# EAGLE design Main_BoardV1 (EAGLE 9.6.2)
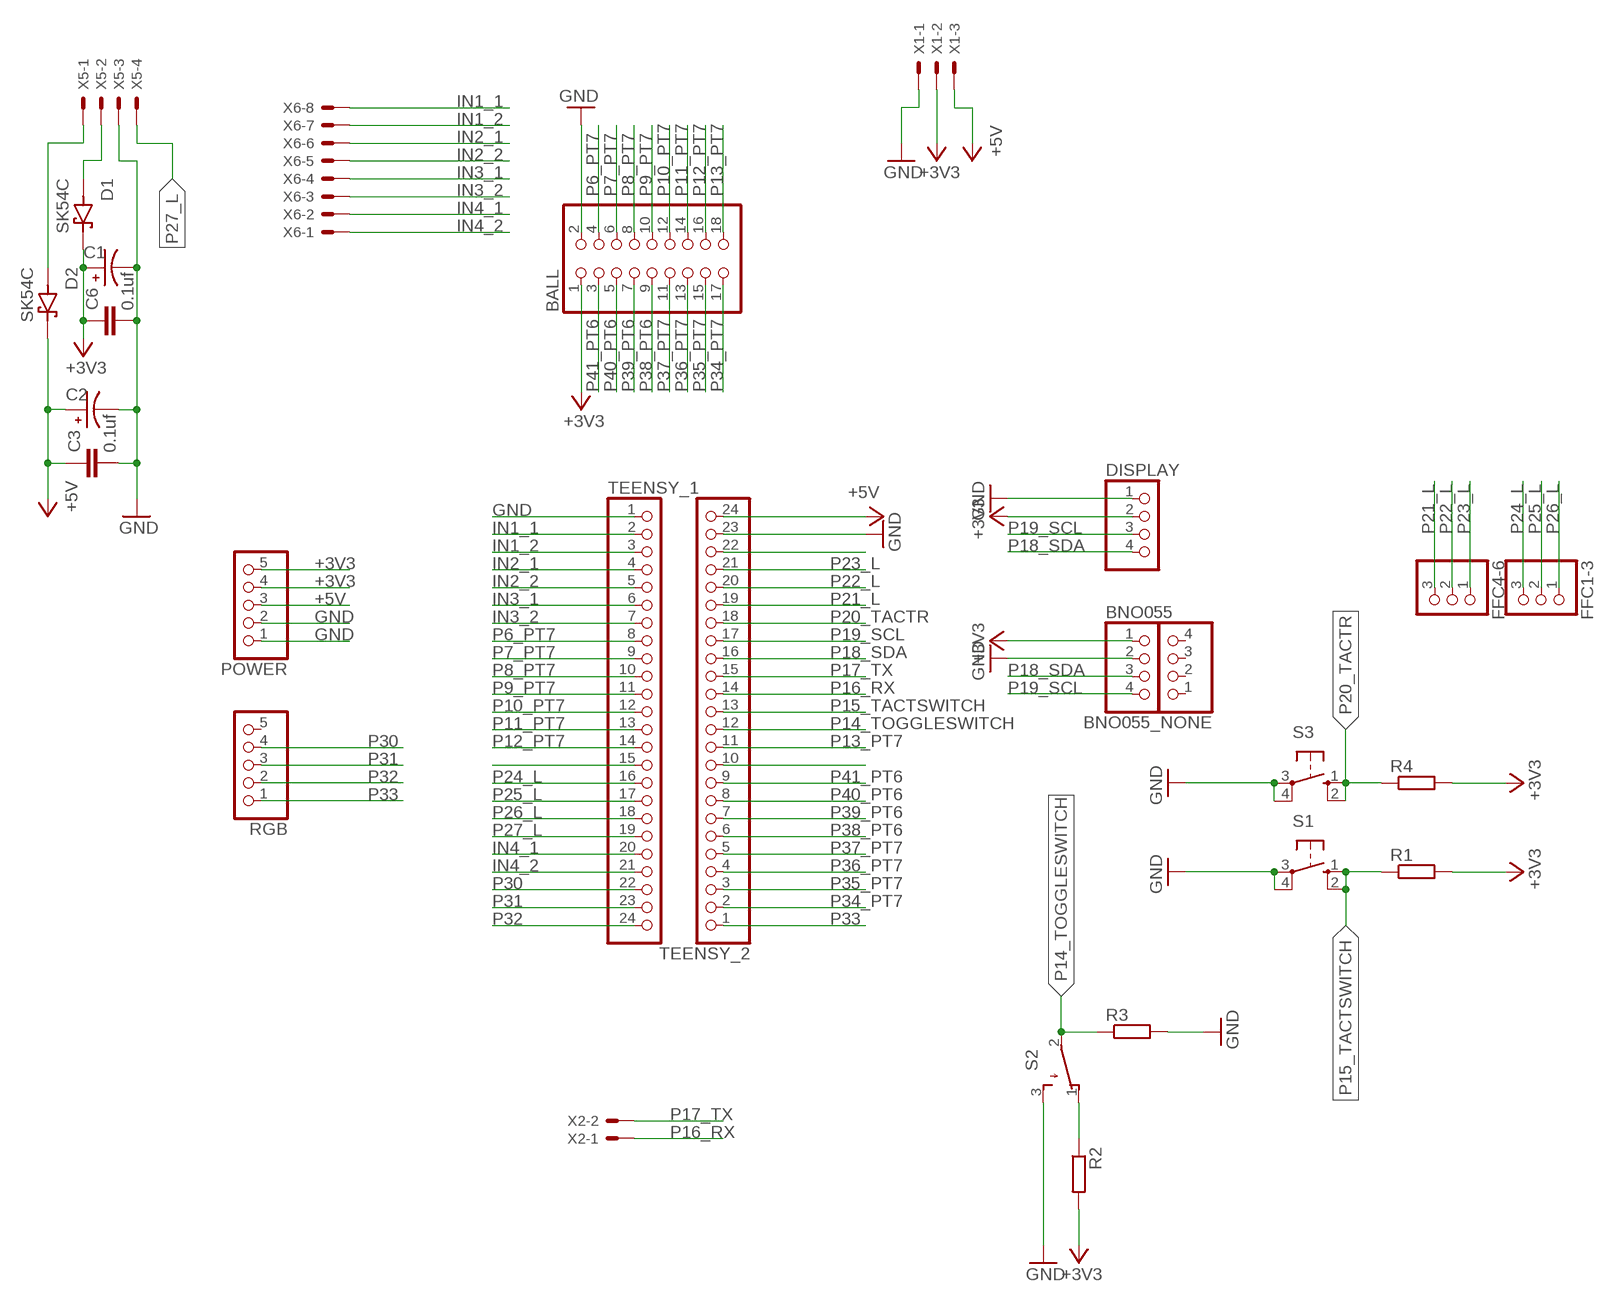
[diagram p0: schematic, sheet 1]

## Parts
BALL  PINHD-2X9  [2X09]
BNO055  PINHD-1X4  [1X04]
BNO055_NONE  PINHD-1X4  [1X04]
C1  EEEFK1E332AM  [CAP_EEEFK1E332AM]
C2  EEEFK1E332AM  [CAP_EEEFK1E332AM]
C3  0.1uf  C-EUC0603  [C0603]
C6  0.1uf  C-EUC0603  [C0603]
D1  SK54C  [DIOM6859X262N]
D2  SK54C  [DIOM6859X262N]
DISPLAY  PINHD-1X04_2.54-S  [1X04-S]
FFC1-3  PINHD-1X03_2.54-S  [1X03-S]
FFC4-6  PINHD-1X03_2.54-S  [1X03-S]
POWER  PINHD-1X05_2.54-S  [1X05-S]
R1  R-EU_0207/10  [0207/10]
R2  R-EU_0207/10  [0207/10]
R3  R-EU_0207/10  [0207/10]
R4  R-EU_0207/10  [0207/10]
RGB  PINHD-1X05_2.54-S  [1X05-S]
S1  40-XX  [B3F-40XX]
S2  TL32PO  [TL3XPO]
S3  10-XX  [B3F-10XX]
TEENSY_1  PINHD-1X24  [1X24]
TEENSY_2  PINHD-1X24  [1X24]
X1  JST-XH-03-PIN-ROUND-PAD  [JST-XH-03-PACKAGE-ROUND-PAD]
X2  JST-XH-02-PIN-ROUND-PAD  [JST-XH-02-PACKAGE-ROUND-PAD]
X5  JST-XH-04-PIN-ROUND-PAD  [JST-XH-04-PACKAGE-ROUND-PAD]
X6  JST-XH-08-PIN-ROUND-PAD  [JST-XH-08-PACKAGE-ROUND-PAD]

## Nets
+3V3: BALL.1 BNO055.1 C1.1 C6.1 D1.C(K) DISPLAY.2 POWER.4 POWER.5 R1.2 R2.2 R4.2 X1.2
+5V: C2.1 C3.1 D2.C(K) POWER.3 TEENSY_2.24 X1.3
GND: BALL.2 BNO055.2 C1.2 C2.2 C3.2 C6.2 DISPLAY.1 POWER.1 POWER.2 R3.2 S1.3(P) S1.4(P1) S2.3(S) S3.3(P) S3.4(P1) TEENSY_1.1 TEENSY_2.23 X1.1 X5.3
IN1_1: TEENSY_1.2 X6.8
IN1_2: TEENSY_1.3 X6.7
IN2_1: TEENSY_1.4 X6.6
IN2_2: TEENSY_1.5 X6.5
IN3_1: TEENSY_1.6 X6.4
IN3_2: TEENSY_1.7 X6.3
IN4_1: TEENSY_1.20 X6.2
IN4_2: TEENSY_1.21 X6.1
N$1: D1.A X5.2
N$2: D2.A X5.1
N$3: TEENSY_2.22
N$8: R2.1 S2.1(O)
N$16: TEENSY_2.10
N$35: TEENSY_1.15
P6_PT7: BALL.4 TEENSY_1.8
P7_PT7: BALL.6 TEENSY_1.9
P8_PT7: BALL.8 TEENSY_1.10
P9_PT7: BALL.10 TEENSY_1.11
P10_PT7: BALL.12 TEENSY_1.12
P11_PT7: BALL.14 TEENSY_1.13
P12_PT7: BALL.16 TEENSY_1.14
P13_PT7: BALL.18 TEENSY_2.11
P14_TOGGLESWITCH: R3.1 S2.2(P) TEENSY_2.12
P15_TACTSWITCH: R1.1 S1.1(S) S1.2(S1) TEENSY_2.13
P16_RX: TEENSY_2.14 X2.1
P17_TX: TEENSY_2.15 X2.2
P18_SDA: BNO055.3 DISPLAY.4 TEENSY_2.16
P19_SCL: BNO055.4 DISPLAY.3 TEENSY_2.17
P20_TACTR: R4.1 S3.1(S) S3.2(S1) TEENSY_2.18
P21_L: FFC4-6.3 TEENSY_2.19
P22_L: FFC4-6.2 TEENSY_2.20
P23_L: FFC4-6.1 TEENSY_2.21
P24_L: FFC1-3.3 TEENSY_1.16
P25_L: FFC1-3.2 TEENSY_1.17
P26_L: FFC1-3.1 TEENSY_1.18
P27_L: TEENSY_1.19 X5.4
P30: RGB.4 TEENSY_1.22
P31: RGB.3 TEENSY_1.23
P32: RGB.2 TEENSY_1.24
P33: RGB.1 TEENSY_2.1
P34_PT7: BALL.17 TEENSY_2.2
P35_PT7: BALL.15 TEENSY_2.3
P36_PT7: BALL.13 TEENSY_2.4
P37_PT7: BALL.11 TEENSY_2.5
P38_PT6: BALL.9 TEENSY_2.6
P39_PT6: BALL.7 TEENSY_2.7
P40_PT6: BALL.5 TEENSY_2.8
P41_PT6: BALL.3 TEENSY_2.9
Unconnected: BNO055_NONE.1 BNO055_NONE.2 BNO055_NONE.3 BNO055_NONE.4 RGB.5

## Library data of the parts
BALL = pinhead:PINHD-2X9: PIN HEADER
BNO055 BNO055_NONE = pinhead:PINHD-1X4: PIN HEADER
C1 C2 = EEEFK1E332AM:EEEFK1E332AM: Check availability <https://pricing.snapeda.com/parts/EEEFK1E332AM/Panasonic/view-part?ref=eda>; AVAILABILITY: In Stock; DESCRIPTION: 3300µF 25V Aluminum Electrolytic Capacitors Radial, Can - SMD 5000 Hrs @ 105°C; MF: Panasonic; MP: EEEFK1E332AM; PACKAGE: RADIAL-2 Panasonic; PRICE: None; PURCHASE-URL: https://pricing.snapeda.com/search/part/EEEFK1E332AM/?ref=eda
C3 C6 = rcl:C-EU: CAPACITOR, European symbol; SPICEPREFIX: C
D1 D2 = SK54C:SK54C: Check availability <https://pricing.snapeda.com/parts/SK54C/Taiwan%20Semiconductor/view-part?ref=eda>; AVAILABILITY: In Stock; DESCRIPTION: 5A, 40V, Schottky Rectifier; MF: Taiwan Semiconductor; MP: SK54C; PACKAGE: SMC-2 Taiwan Semiconductor; PRICE: None; PURCHASE-URL: https://pricing.snapeda.com/search/part/SK54C/?ref=eda
DISPLAY = pinhead-2:PINHD-1X04: PIN HEADER
FFC1-3 FFC4-6 = pinhead-2:PINHD-1X03: PIN HEADER
POWER RGB = pinhead-2:PINHD-1X05: PIN HEADER
R1-R4 = rcl:R-EU_: RESISTOR, European symbol; SPICEPREFIX: R
S1 = switch-omron:40-XX: OMRON SWITCH; MF: OMRON COMPONENTS USA; MPN: B3F-4000; OC_FARNELL: 176434; OC_NEWARK: 36K3105
S2 = switch:TL32PO: TINY SWITCH ON - MOM Source: http://www2.produktinfo.conrad.com/datenblaetter/700000-724999/705152-da-01-de-Subminiaturschalter_TL_36YO.pdf
S3 = switch-omron:10-XX: OMRON SWITCH; MPN: B3F-1000; OC_FARNELL: 176432; OC_NEWARK: 36M3542
TEENSY_1 TEENSY_2 = pinhead:PINHD-1X24: PIN HEADER
X1 = Rembrandt Electronics - JST XH Connectors v1-0:JST-XH-03-PIN: JST XH Connector 2 Pin Wire to board connector. Pitch: 2,54 mm, (0.100") Number of pins: 3 Created by Rembrandt Electronics www.rembrandtelectronics.com
X2 = Rembrandt Electronics - JST XH Connectors v1-0:JST-XH-02-PIN: JST XH Connector 2 Pin Wire to board connector. Pitch: 2,54 mm, (0.100") Number of pins: 2 Created by Rembrandt Electronics www.rembrandtelectronics.com
X5 = Rembrandt Electronics - JST XH Connectors v1-0:JST-XH-04-PIN: JST XH Connector 2 Pin Wire to board connector. Pitch: 2,54 mm, (0.100") Number of pins: 4 Created by Rembrandt Electronics www.rembrandtelectronics.com
X6 = Rembrandt Electronics - JST XH Connectors v1-0:JST-XH-08-PIN: JST XH Connector 2 Pin Wire to board connector. Pitch: 2,54 mm, (0.100") Number of pins: 8 Created by Rembrandt Electronics www.rembrandtelectronics.com

## Net classes
0 default: clearance 1 mm

## Board
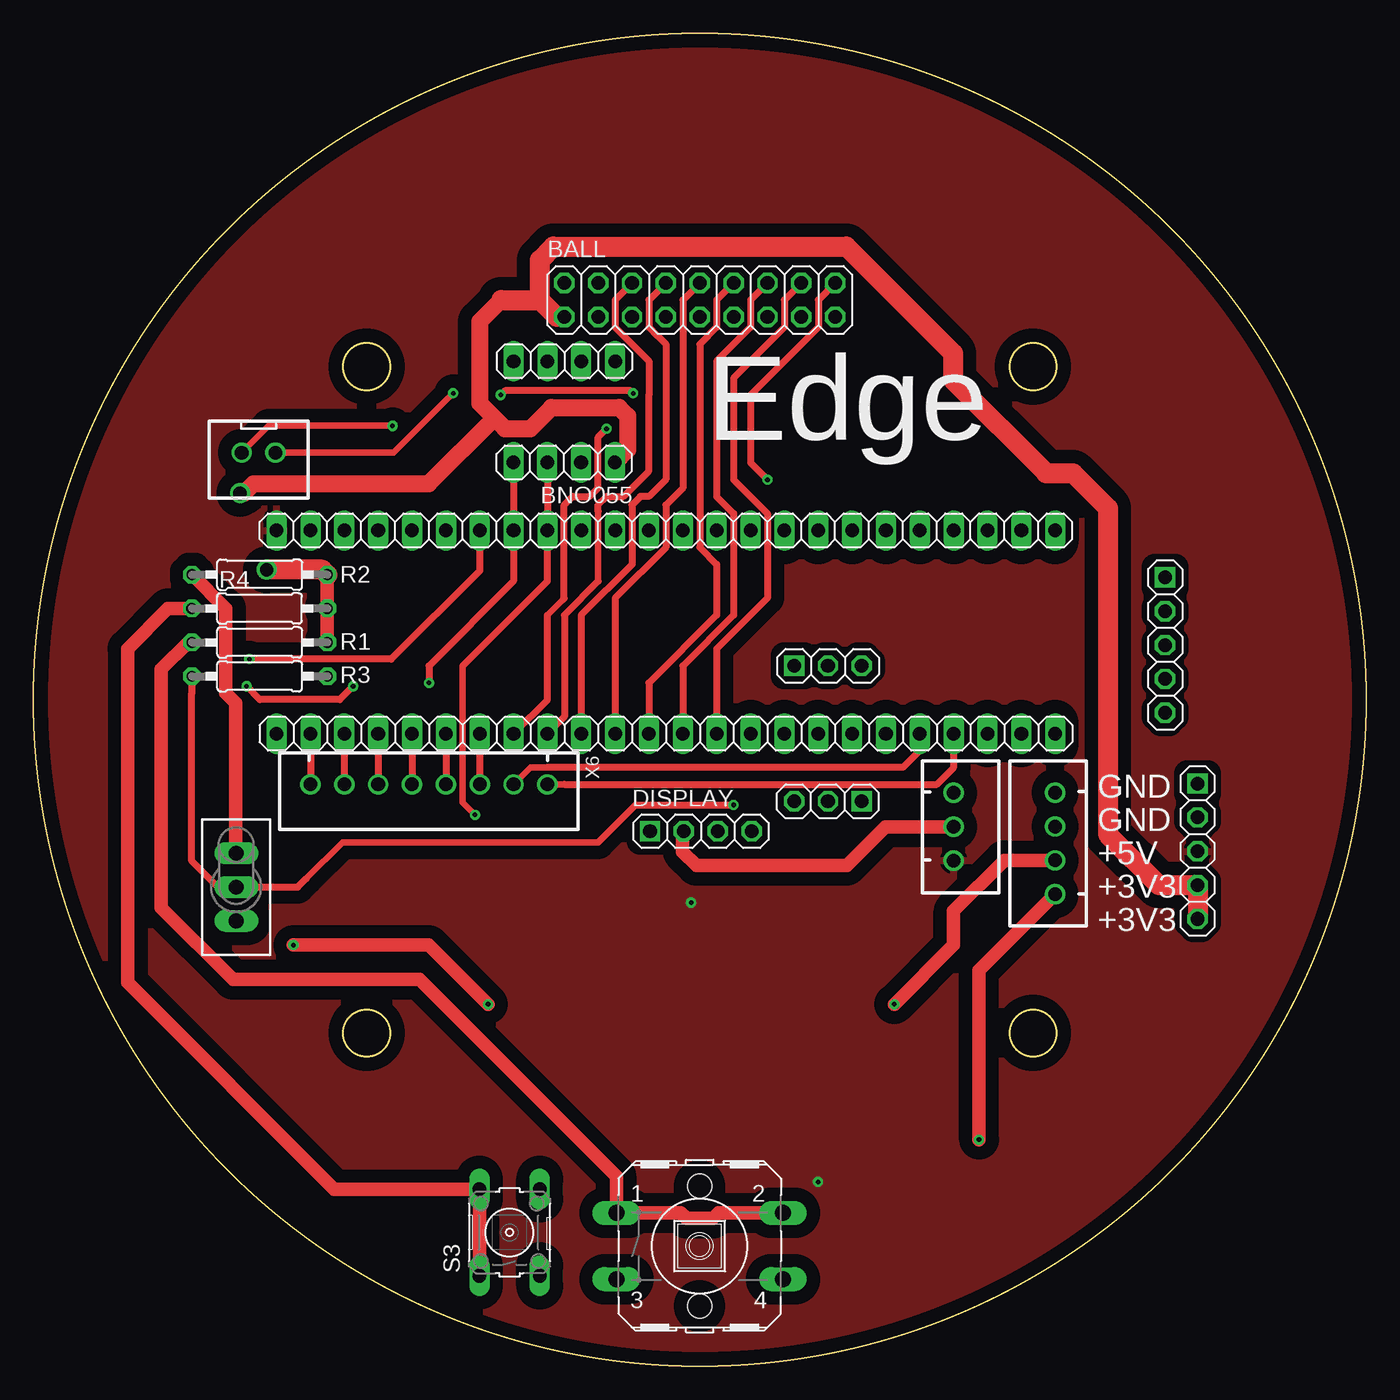
[diagram p1: board, top side]
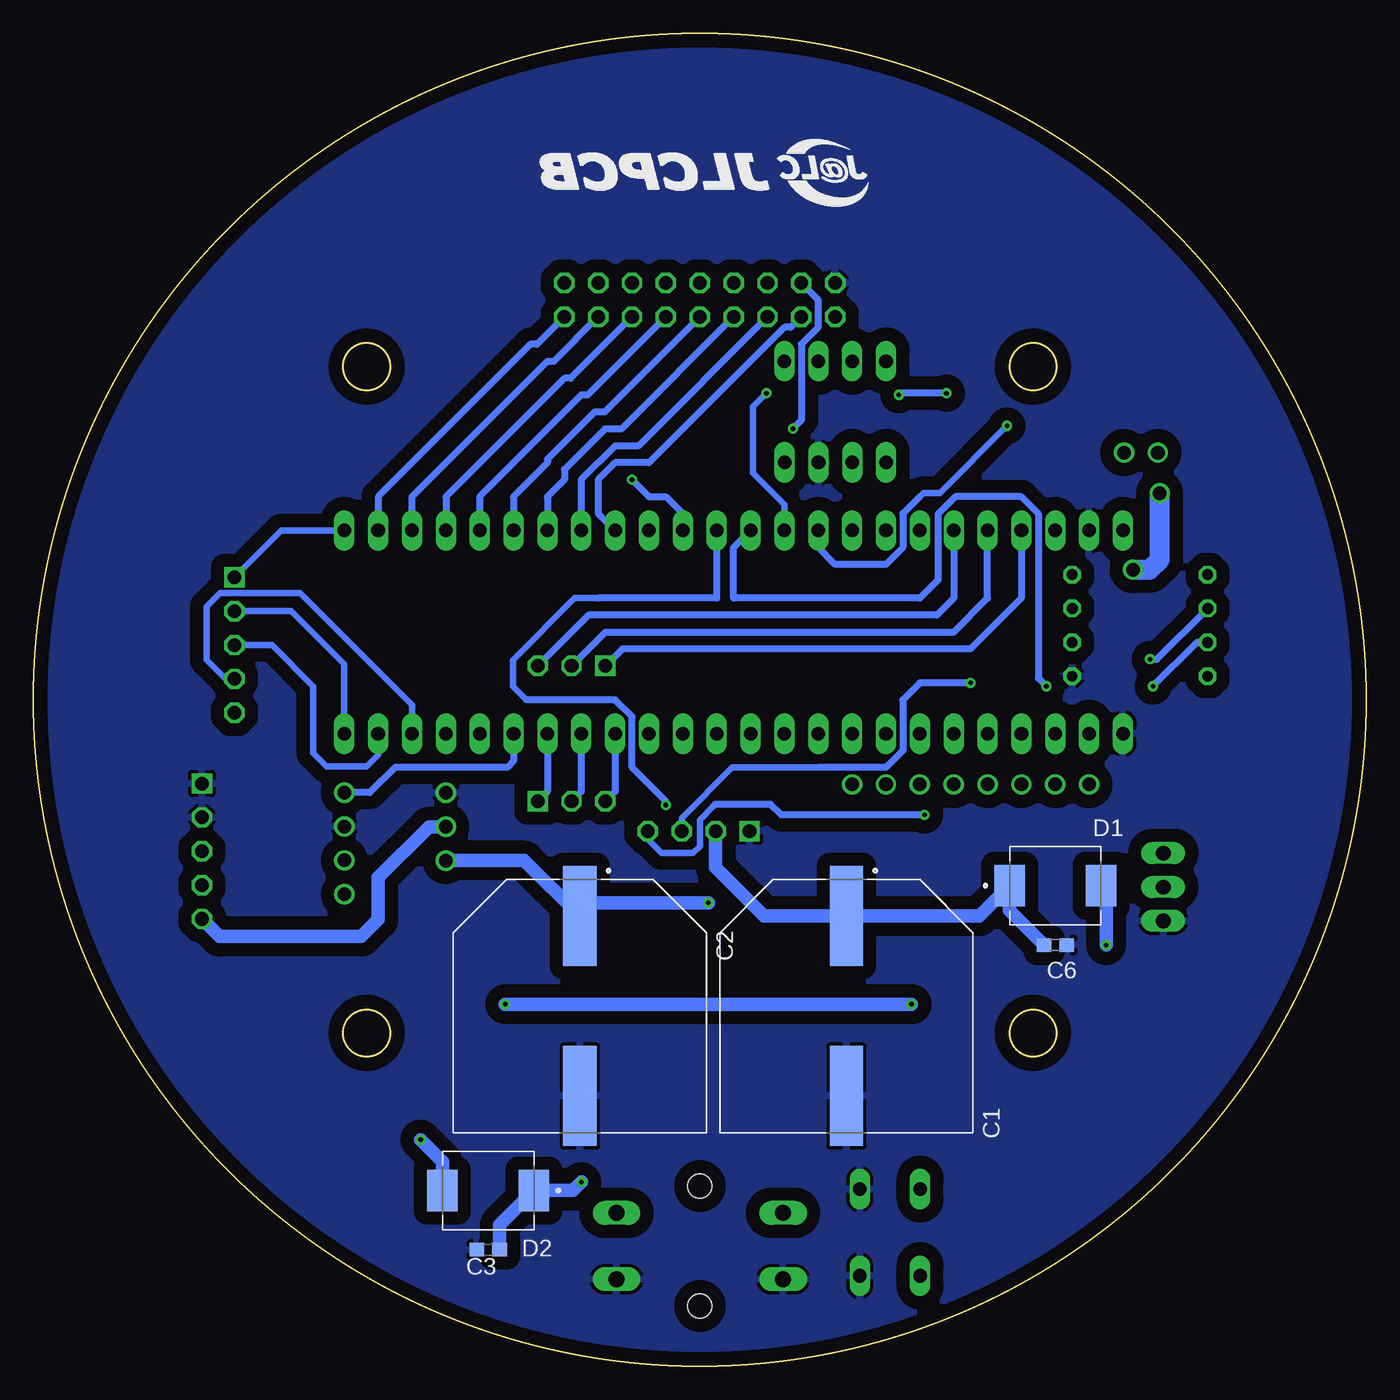
[diagram p2: board, bottom side, seen from below]

Size 100 x 100 mm. Coordinates in mm from the lower left corner, seen from the top.
Outline: circle at 50,50 radius 50
Outline: circle at 75,75 radius 1.75
Outline: circle at 25,75 radius 1.75
Outline: circle at 25,25 radius 1.75
Outline: circle at 75,25 radius 1.75
Copper layers (1*16): Top 0.035mm / dielectric 1.5mm / Bottom 0.035mm
Design rules "default": minimum track width 6mil, minimum drill 0.35mm, track to track 6mil, track to pad 6mil, pad to pad 6mil, via to via 6mil, smd to smd 6mil, copper to edge 40mil, drill to drill 6mil, minimum pad ring 10mil, minimum via ring 8mil, stop-mask expansion 4mil, vias tented up to drill 0mil, thermal gap 10mil

### Footprints (pad centres in the part's own frame; a part is rotated, then mirrored left to right if it is on the bottom)
2X09 = drill 1.016 octagon: 1 -10.16,-1.27; 2 -10.16,1.27; 3 -7.62,-1.27; 4 -7.62,1.27; 5 -5.08,-1.27; 6 -5.08,1.27; 7 -2.54,-1.27; 8 -2.54,1.27; 9 0,-1.27; 10 0,1.27; 11 2.54,-1.27; 12 2.54,1.27; 13 5.08,-1.27; 14 5.08,1.27; 15 7.62,-1.27; 16 7.62,1.27; 17 10.16,-1.27; 18 10.16,1.27
1X04 = drill 1.016 long: 1 -3.81,0; 2 -1.27,0; 3 1.27,0; 4 3.81,0
CAP_EEEFK1E332AM = smd 7.5 x 2.5: 1 -6.75,0; 2 6.75,0
C0603 = smd 1.1 x 1: 1 -0.85,0; 2 0.85,0
DIOM6859X262N = smd 2.29 x 3.12: A 3.43,0; C -3.43,0
1X04-S = drill 1.016 square: 1 -3.81,0 | drill 1.016 octagon: 2 -1.27,0; 3 1.27,0; 4 3.81,0
1X03-S = drill 1.016 square: 1 -2.54,0 | drill 1.016 octagon: 2 0,0; 3 2.54,0
1X05-S = drill 1.016 square: 1 -5.08,0 | drill 1.016 octagon: 2 -2.54,0; 3 0,0; 4 2.54,0; 5 5.08,0
0207/10 = drill 0.813 octagon: 1 -5.08,0; 2 5.08,0
B3F-40XX = drill 1.194 long: 1 -6.248,2.489; 2 6.248,2.489; 3 -6.248,-2.489; 4 6.248,-2.489 | hole 1.803: 0,-4.496; 0,4.496
TL3XPO = drill 1.1 pad 1.422 long: 1 -2.54,0; 2 0,0; 3 2.54,0
B3F-10XX = drill 1.016 long: 1 -3.251,2.261; 2 3.251,2.261; 3 -3.251,-2.261; 4 3.251,-2.261
1X24 = drill 1.016 long: 1 -29.21,0; 2 -26.67,0; 3 -24.13,0; 4 -21.59,0; 5 -19.05,0; 6 -16.51,0; 7 -13.97,0; 8 -11.43,0; 9 -8.89,0; 10 -6.35,0; 11 -3.81,0; 12 -1.27,0; 13 1.27,0; 14 3.81,0; 15 6.35,0; 16 8.89,0; 17 11.43,0; 18 13.97,0; 19 16.51,0; 20 19.05,0; 21 21.59,0; 22 24.13,0; 23 26.67,0; 24 29.21,0
JST-XH-03-PACKAGE-ROUND-PAD = drill 1.016: 1 -2.54,0; 2 0,0; 3 2.54,0
JST-XH-02-PACKAGE-ROUND-PAD = drill 1.016: 1 -1.27,0; 2 1.27,0
JST-XH-04-PACKAGE-ROUND-PAD = drill 1.016: 1 -3.81,0; 2 -1.27,0; 3 1.27,0; 4 3.81,0
JST-XH-08-PACKAGE-ROUND-PAD = drill 1.016: 1 -8.89,0; 2 -6.35,0; 3 -3.81,0; 4 -1.27,0; 5 1.27,0; 6 3.81,0; 7 6.35,0; 8 8.89,0

### Placement (x,y rotation side)
BALL  50,80 0 top
BNO055  39.82,67.81 180 top
BNO055_NONE  39.84,75.4 0 top
C1  38.99,27.01 270 bottom
C2  58.99,27.01 270 bottom
C3  65.87,8.74 180 bottom
C6  23.32,31.6 0 bottom
D1  23.32,36.04 0 bottom
D2  65.87,13.18 180 bottom
DISPLAY  50.08,40.14 0 top
FFC1-3  59.62,42.38 180 top
FFC4-6  59.62,52.54 0 top
POWER  87.35,38.64 270 top
R1  16.98,54.3 0 top
R2  16.98,59.38 0 top
R3  16.98,51.76 0 top
R4  16.97,56.85 0 top
RGB  84.92,54.1 270 top
S1  49.99,9.01 0 top
S2  15.22,35.95 270 top
S3  35.73,10.03 90 top
TEENSY_1  47.46,47.46 0 top
TEENSY_2  47.46,62.7 180 top
X1  69.05,40.48 270 top
X2  16.9,68.54 180 top
X5  76.66,39.22 90 top
X6  29.68,43.65 180 top

### Tracks (layer width: path | path; a pad name or v marks a point on that pad's centre or on a via)
+3V3  (via drill 1)
  Top 1.016: R1.2 R4.2 R2.2 | DISPLAY.2 48.72,40.05 48.72,38.58 49.74,37.57 61.04,37.57 63.95,40.47 X1.2
  Top 1.27: 35.1,80 33.48,78.39 33.48,72.24 34.59,71.13 | 34.59,71.13 35.39,70.33 37.29,70.33 38.88,71.92 43.96,71.92 44.59,71.29 44.59,68.76 BNO055.1 | 34.59,71.13 29.67,66.2 16.52,66.2 15.82,65.5 v15.5,65.5
  Top 1.5: POWER.5 POWER.4 84.45,36.09 80.64,39.9 80.64,64.36 78,67 76,67 69,74 69,76 61,84 39,84 38,83 38,80 | BALL.1 39.27,78.73 38,80 | 35.1,80 38,80 | R2.2 21.68,59.76 v17.5,59.76
  Bottom 1.016: C6.1 26.75,34.18 D1.C 29.03,33.76 C1.1 45.17,33.76 48.81,37.4 DISPLAY.2 | X1.2 70.32,40.47 74.12,36.67 74.12,33.5 75.39,32.23 86.03,32.23 POWER.5
  Bottom 1.5: v17.5,59.76 16.24,59.76 15.5,60.5 v15.5,65.5
+5V  (via drill 0.35)
  Bottom 1.016: C3.1 65.02,10.6 D2.C 59.52,13.18 v58.88,13.82 | X1.3 63.16,37.93 C2.1 57.98,34.77 v49.36,34.77
  pour Top: 29.68,100.8 69.05,100.8 100.8,69.05 100.8,29.68 71.59,0.47 28.41,0.47 0.47,28.41 0.47,71.59
GND
  pour Bottom: 30.95,99.53 32.22,100.8 69.05,100.8 100.8,69.05 100.8,29.68 71.59,0.47 28.41,0.47 -0.8,29.68 -0.8,69.05 29.68,99.53
IN1_1
  Top 0.508: TEENSY_1.2 X6.8
IN1_2
  Top 0.508: TEENSY_1.3 X6.7
IN2_1
  Top 0.508: TEENSY_1.4 X6.6
IN2_2
  Top 0.508: TEENSY_1.5 X6.5
IN3_1
  Top 0.508: TEENSY_1.6 X6.4
IN3_2
  Top 0.508: TEENSY_1.7 X6.3
IN4_1
  Top 0.5: 38.57,44.92 37.3,44.92 X6.2
  Top 0.508: TEENSY_1.20 66.51,46.19 65.24,44.92 38.57,44.92
IN4_2
  Top 0.5: X6.1 39.84,43.65
  Top 0.508: TEENSY_1.21 69.05,44.92 67.78,43.65 39.84,43.65
N$1  (via drill 0.35)
  Top 1.016: v19.51,31.6 29.67,31.6 v34.12,27.15 | v64.6,27.15 69.04,31.6 69.04,34.14 72.85,37.95 X5.2
  Bottom 1.016: v19.51,31.6 19.51,35.66 D1.A | v34.12,27.15 v64.6,27.15
N$2  (via drill 0.35)
  Top 1.016: v70.95,16.99 70.95,29.69 X5.1
  Bottom 1.016: D2.A 69.3,15.34 v70.95,16.99
N$8
  Top 1.016: R2.1 14.43,56.85 14.43,50.52 15.19,49.76 15.19,39.09 15.22,39.06 S2.1
P6_PT7  (via drill 0.35)
  Top 0.5: 38.57,56.35 39.73,57.51
  Top 0.508: TEENSY_1.8 38.57,50 38.57,56.35 | 39.73,57.51 39.83,57.61 39.83,64.62 40.47,65.25 41.74,65.25 42.37,65.89 42.37,69.7 v43.01,70.33
  Bottom 0.508: v43.01,70.33 42.37,70.97 42.37,76.68 41.1,77.95 41.1,79.99 BALL.4
P7_PT7
  Top 0.5: 42.38,58.89 42.38,64.12
  Top 0.508: BALL.6 43.65,80 43.65,77.94 45.54,76.05 45.55,76.05 46.18,75.41 46.18,72.87 46.18,67.16 44.28,65.25 43.01,65.25 42.38,64.63 42.38,64.12 | TEENSY_1.9 39.84,48.73 39.84,56.35 42.38,58.89
P8_PT7
  Top 0.508: BALL.8 46.19,80 46.19,77.94 46.81,77.32 46.82,77.32 47.45,76.68 47.45,66.52 46.18,65.25 45.55,65.25 44.91,64.62 44.91,60.17 44.92,60.16 41.11,56.35 TEENSY_1.10
P9_PT7
  Top 0.508: BALL.10 48.73,80 48.73,65.9 47.45,64.62 47.45,61.44 47.46,61.43 43.65,57.62 TEENSY_1.11
P10_PT7
  Top 0.508: BALL.12 51.27,80 51.27,77.94 50,76.67 50,61.43 51.27,60.16 51.27,56.35 46.19,51.27 TEENSY_1.12
P11_PT7
  Top 0.508: BALL.14 53.81,80 53.81,77.94 51.27,75.4 51.27,65.24 52.54,63.97 52.54,56.35 48.73,52.54 TEENSY_1.13
P12_PT7
  Top 0.508: BALL.16 56.35,80 56.35,77.94 52.54,74.13 52.54,66.51 55.08,63.97 55.08,57.62 51.27,53.81 TEENSY_1.14
P13_PT7  (via drill 0.35)
  Top 0.508: BALL.18 58.89,80 58.89,77.94 53.81,72.86 53.81,67.78 v55.08,66.51
  Bottom 0.508: v55.08,66.51 53.81,65.24 52.54,65.24 51.27,63.97 TEENSY_2.11
P14_TOGGLESWITCH  (via drill 0.35)
  Top 0.5: 42.38,39.3 23.2,39.3 20.48,36.58
  Top 0.508: 42.38,39.3 45.19,42.11 v52.54,42.11 | R3.1 11.9,50.5 11.89,50.5 11.89,37.89 13.84,35.95 S2.2 19.85,35.95 20.48,36.58
  Bottom 0.5: 57.62,57.62 59.38,57.62 64,53 64,51 63,50
  Bottom 0.508: v52.54,42.11 52.54,42.38 55.08,44.92 55.08,48.73 56.35,50 63,50 | 57.62,57.62 48.73,57.62 TEENSY_2.12
P15_TACTSWITCH  (via drill 0.35)
  Top 0.508: v23.99,51.01 22.99,50.01 16.99,50.01 v15.99,51.01
  Top 1.016: R1.1 11.61,54.3 9.61,52.3 9.61,34.4 14.99,29.01 28.99,29.01 43.74,14.26 S1.1 48.57,11.5 48.99,11.08 51,11.08 51.42,11.5 S1.2
  Bottom 0.508: TEENSY_2.13 47.46,61.43 47.46,57.62 33.49,57.62 32.12,58.99 32.12,63.95 30.82,65.24 25.87,65.24 24.6,63.97 24.6,51.62 v23.99,51.01 | v15.99,51.01 12.7,54.3 R1.1
P16_RX  (via drill 0.35)
  Top 0.5: X2.1 27.04,68.54 v31.5,73
  Top 0.508: v35.07,72.87 35.39,73.19 44.81,73.19 v45,73
  Bottom 0.5: v45,73 46,72 46,67 43.65,64.65 TEENSY_2.14
  Bottom 0.508: v31.5,73 34.94,73 v35.07,72.87
P17_TX  (via drill 0.35)
  Top 0.5: X2.2 17.64,70.55 v26.95,70.55
  Bottom 0.5: v26.95,70.55 32,65.5 33.23,65.5 33.49,65.24
  Bottom 0.508: 33.49,65.24 34.76,63.97 34.76,61.43 36.03,60.16 39.84,60.16 41.11,61.43 TEENSY_2.15
P18_SDA  (via drill 0.35)
  Top 0.5: 32.22,52.54 32.22,42.28 v33.14,41.36
  Top 0.508: 32.22,52.54 38.57,58.89 TEENSY_2.16 38.57,67.79 BNO055.3
  Bottom 0.5: 49,42 50,41 50,39 50.5,38.5 52.89,38.5 53.89,39.5 DISPLAY.4
  Bottom 0.508: v33.14,41.36 43.88,41.36 44.68,42.16 48.84,42.16 49,42
P19_SCL  (via drill 0.35)
  Top 0.508: v29.68,51.27 29.68,52.54 36.03,58.89 TEENSY_2.17 36.03,67.79 BNO055.4
  Bottom 0.5: 41.11,44.92 47.58,44.92 51.35,41.15 DISPLAY.3
  Bottom 0.508: v29.68,51.27 33.49,51.27 34.76,50 34.76,46.19 36.03,44.92 41.11,44.92
P20_TACTR  (via drill 0.35)
  Top 0.508: TEENSY_2.18 33.49,59.67 26.86,53.04 v16.21,53.04
  Top 1.016: R4.1 10.1,56.85 7.07,53.82 7.07,28.8 22.59,13.28 S3.2 S3.1
  Bottom 0.508: v16.21,53.04 15.7,53.04 R4.1
P21_L
  Bottom 0.508: TEENSY_2.19 30.95,57.62 32.22,56.35 58.35,56.35 FFC4-6.3
P22_L
  Bottom 0.508: FFC4-6.2 57.08,55.08 30.95,55.08 28.41,57.62 TEENSY_2.20
P23_L
  Bottom 0.508: TEENSY_2.21 25.87,57.62 29.68,53.81 55.81,53.81 FFC4-6.1
P24_L
  Bottom 0.508: TEENSY_1.16 56.35,43.11 FFC1-3.3
P25_L
  Bottom 0.508: FFC1-3.2 58.89,43.11 TEENSY_1.17
P26_L
  Bottom 0.508: TEENSY_1.18 61.43,43.11 FFC1-3.1
P27_L
  Bottom 0.508: TEENSY_1.19 63.97,45.4 64.44,44.93 72.85,44.93 74.76,43.03 X5.4
P30
  Bottom 0.5: TEENSY_1.22 71.59,49.59 80,58 86,58 87,57 87,53 85.56,51.56 RGB.4
P31
  Bottom 0.5: TEENSY_1.23 74.13,45.87 75,45 78,45 79,46 79,51 82.1,54.1 RGB.3
P32
  Bottom 0.5: TEENSY_1.24 76.67,52.67 80.64,56.64 RGB.2
P33
  Bottom 0.5: TEENSY_2.1 81.4,62.7 RGB.1
P34_PT7
  Bottom 0.508: BALL.17 62.22,76.67 62.7,76.67 74.13,65.24 TEENSY_2.2
P35_PT7
  Bottom 0.508: TEENSY_2.3 71.59,65.24 61.43,75.4 60.95,75.4 BALL.15
P36_PT7
  Bottom 0.508: BALL.13 59.68,74.13 60.16,74.13 69.05,65.24 TEENSY_2.4
P37_PT7
  Bottom 0.508: BALL.11 58.41,72.86 58.89,72.86 66.51,65.24 TEENSY_2.5
P38_PT6
  Bottom 0.508: BALL.9 57.14,71.59 57.89,71.59 61.43,68.05 61.43,67.78 63.97,65.24 TEENSY_2.6
P39_PT6
  Bottom 0.508: BALL.7 55.87,70.32 57.12,70.32 60.16,67.28 60.16,66.51 61.43,65.24 TEENSY_2.7
P40_PT6
  Bottom 0.508: BALL.5 54.6,69.05 56.35,69.05 58.89,66.51 TEENSY_2.8
P41_PT6
  Bottom 0.508: BALL.3 43.17,77.94 43.65,77.94 53.81,67.78 56.35,67.78 57.62,66.51 57.62,63.97 TEENSY_2.9

### Text on the board
tNames: Edge | GND | GND | +5V | +3V3 | +3V3